# EAGLE board test_board_logic3 (EAGLE 9.3.1)
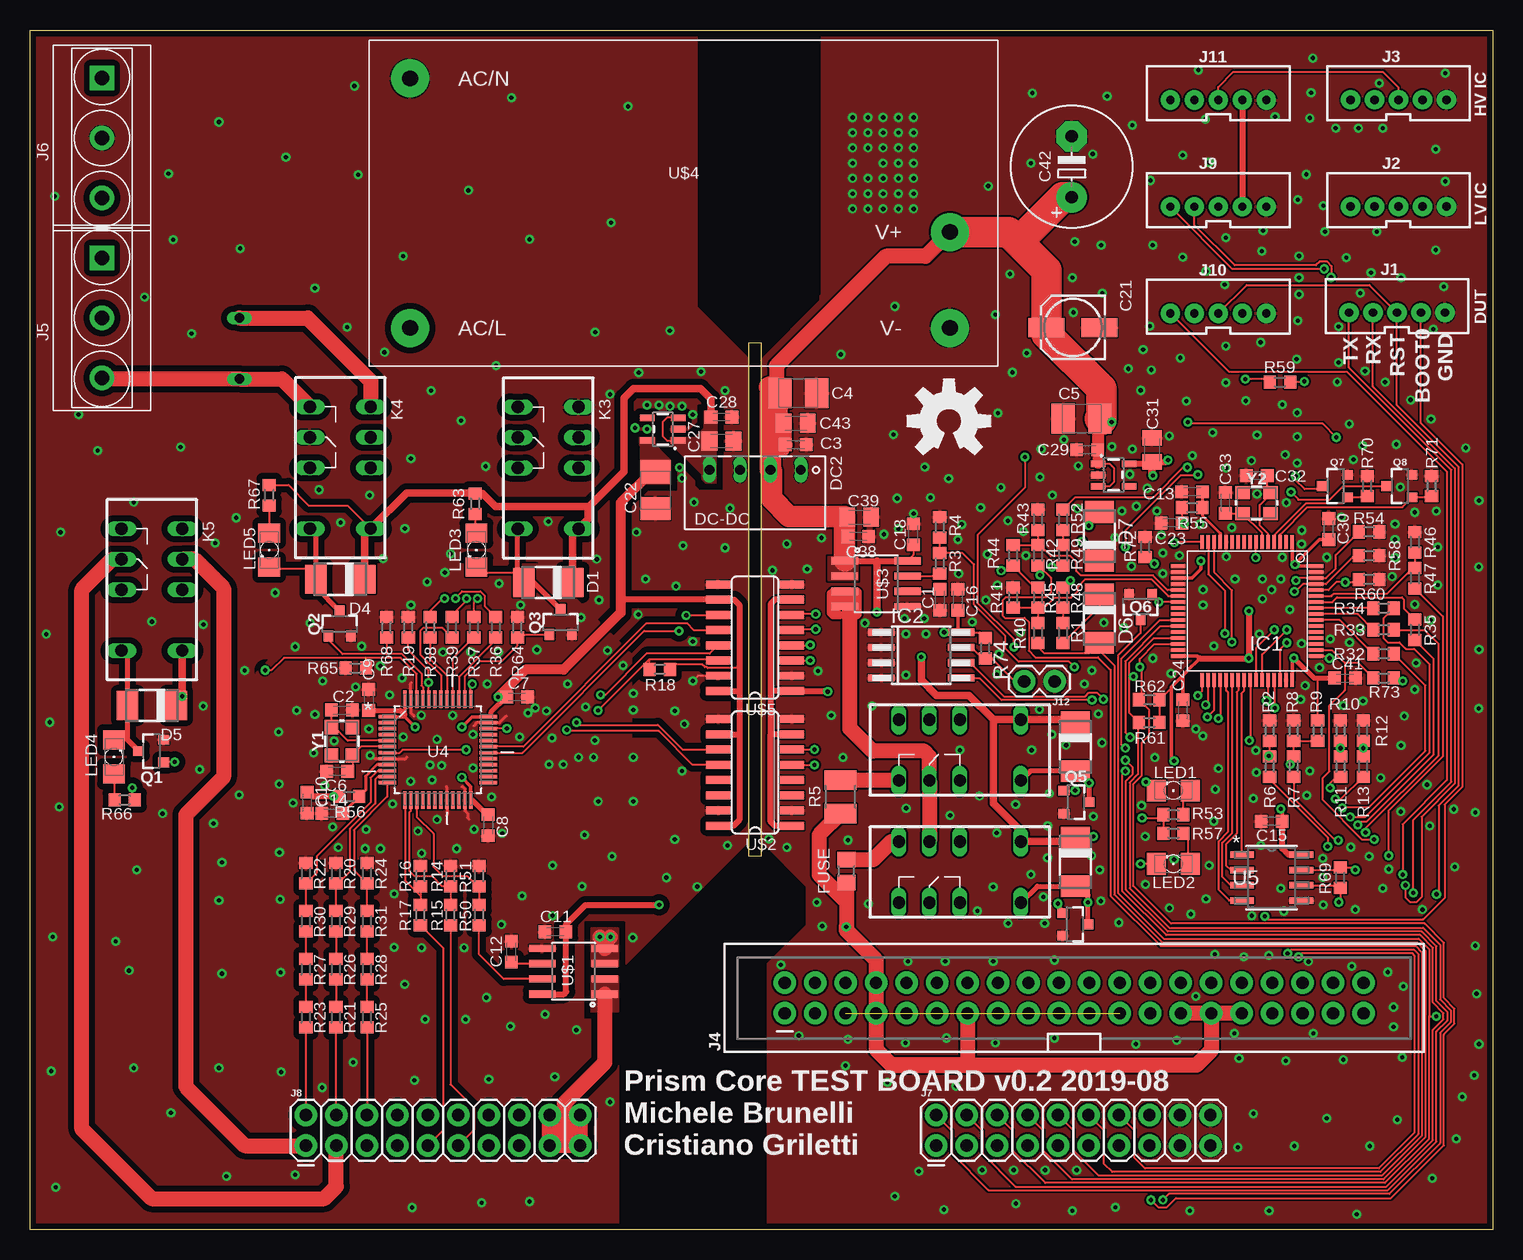
[diagram p5: board, top side]
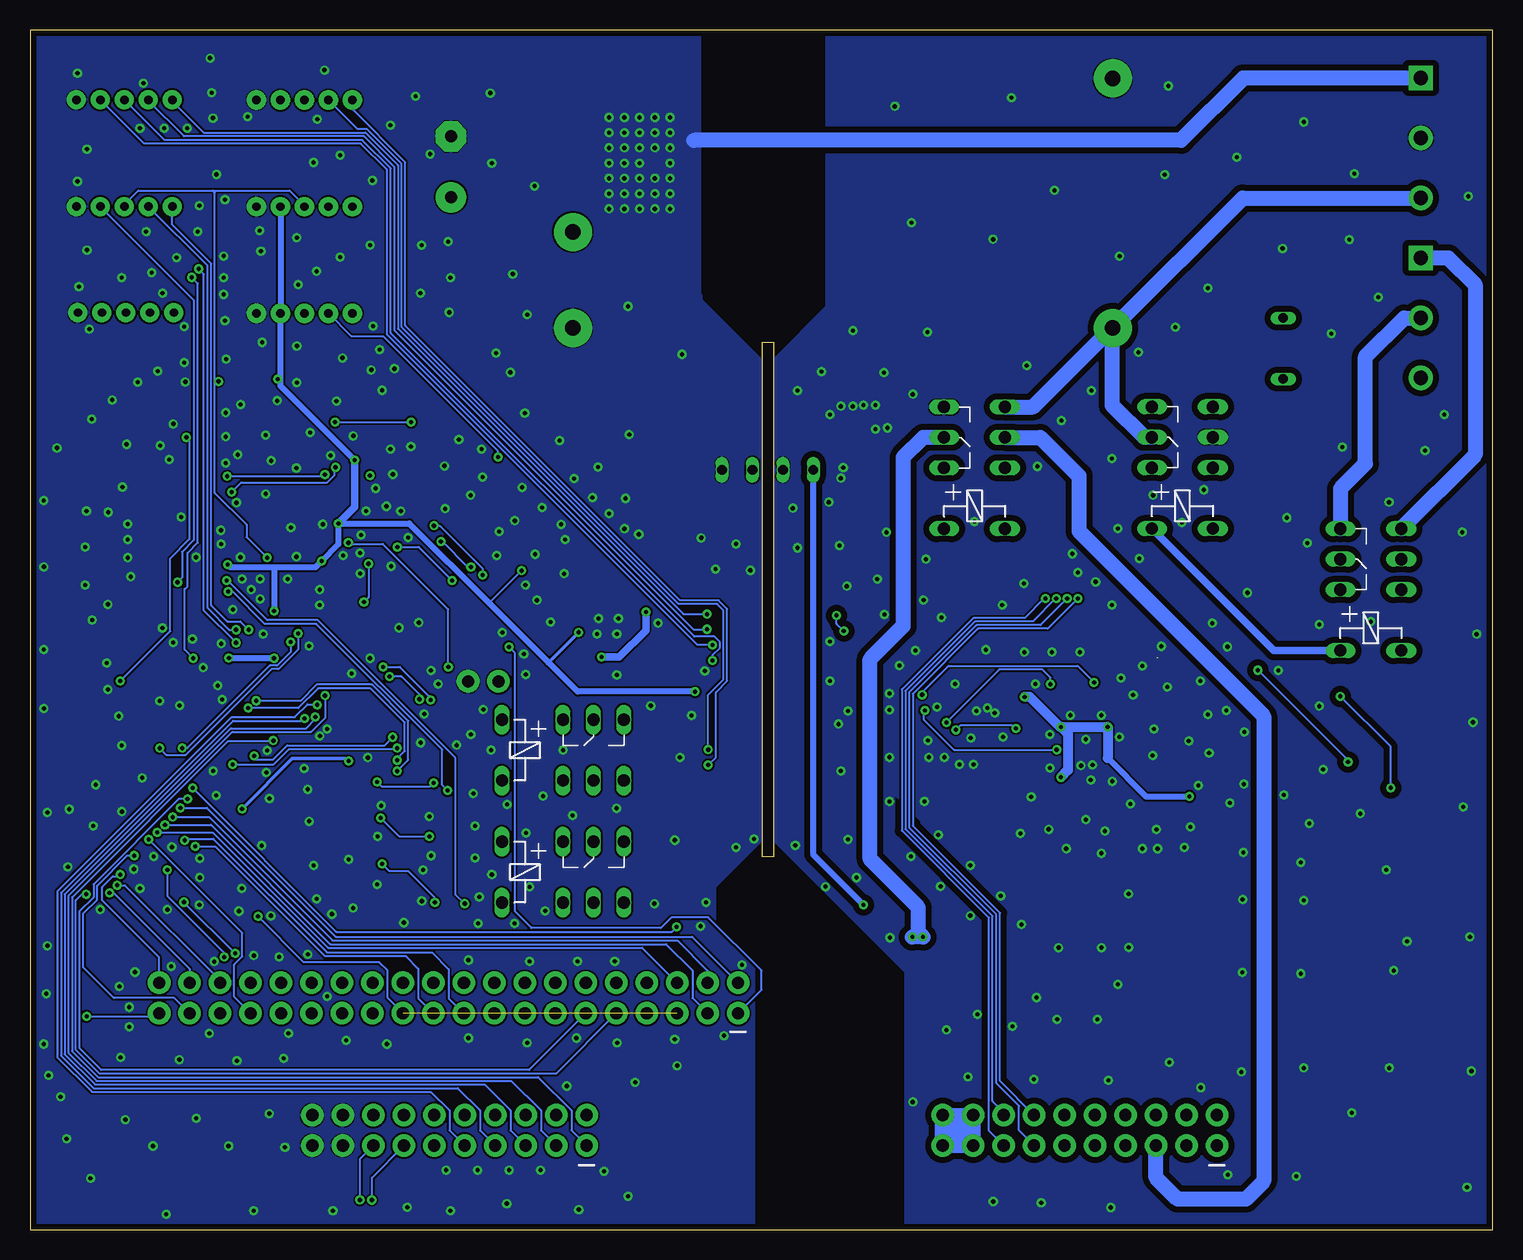
[diagram p6: board, bottom side, seen from below]

Size 121.94 x 100 mm. Coordinates in mm from the lower left corner, seen from the top.
Outline: 0,100 121.94,100 121.94,0 0,0 0,100
Copper layers (1*16): Top 0.035mm / dielectric 1.5mm / Bottom 0.035mm
Design rules "default *": minimum track width 6mil, minimum drill 0.29mm, track to track 6mil, track to pad 6mil, pad to pad 6mil, via to via 6mil, smd to smd 0mil, copper to edge 20mil, drill to drill 6mil, minimum pad ring 5mil, minimum via ring 8mil, stop-mask expansion 4mil, vias tented up to drill 20mil, thermal gap 4mil
Net classes: 1 pwr: width 0.305 mm, drill 0.356 mm, clearance 0.152 mm; 2 analog: width 0.305 mm, drill 0.33 mm, clearance 0.152 mm
Milling: 4 lines

## Footprints (pad centres in the part's own frame; a part is rotated, then mirrored left to right if it is on the bottom)
C0603K = smd 1.05 x 1.08: 1 -0.875,0; 2 0.875,0
C0805K = smd 1.3 x 1.6: 1 -1,0; 2 1,0
B/3528-21R = smd 1.95 x 2.5: + 1.525,0; - -1.525,0
153CLV-0505 = smd 3 x 1.6: + 2.2,0; - -2.2,0
E5-10,5 = drill 1.016 pad 2.54: + -2.54,0 | drill 1.016 pad 2.54 octagon: - 2.54,0
DO-214AC = smd 1.8 x 2.4: A 2.025,0; C -2.025,0
NME = drill 0.813 long: 1 0,3.81; 2 0,1.27; 3 0,-1.27; 4 0,-3.81
R0805 = smd 1.3 x 1.5: 1 -0.95,0; 2 0.95,0
LQFP64 = smd 0.3 x 1.2: 1 -3.75,-5.75; 2 -3.25,-5.75; 3 -2.75,-5.75; 4 -2.25,-5.75; 5 -1.75,-5.75; 6 -1.25,-5.75; 7 -0.75,-5.75; 8 -0.25,-5.75; 9 0.25,-5.75; 10 0.75,-5.75; 11 1.25,-5.75; 12 1.75,-5.75; 13 2.25,-5.75; 14 2.75,-5.75; 15 3.25,-5.75; 16 3.75,-5.75; 33 3.75,5.75; 34 3.25,5.75; 35 2.75,5.75; 36 2.25,5.75; 37 1.75,5.75; 38 1.25,5.75; 39 0.75,5.75; 40 0.25,5.75; 41 -0.25,5.75; 42 -0.75,5.75; 43 -1.25,5.75; 44 -1.75,5.75; 45 -2.25,5.75; 46 -2.75,5.75; 47 -3.25,5.75; 48 -3.75,5.75 | smd 1.2 x 0.3: 17 5.75,-3.75; 18 5.75,-3.25; 19 5.75,-2.75; 20 5.75,-2.25; 21 5.75,-1.75; 22 5.75,-1.25; 23 5.75,-0.75; 24 5.75,-0.25; 25 5.75,0.25; 26 5.75,0.75; 27 5.75,1.25; 28 5.75,1.75; 29 5.75,2.25; 30 5.75,2.75; 31 5.75,3.25; 32 5.75,3.75; 49 -5.75,3.75; 50 -5.75,3.25; 51 -5.75,2.75; 52 -5.75,2.25; 53 -5.75,1.75; 54 -5.75,1.25; 55 -5.75,0.75; 56 -5.75,0.25; 57 -5.75,-0.25; 58 -5.75,-0.75; 59 -5.75,-1.25; 60 -5.75,-1.75; 61 -5.75,-2.25; 62 -5.75,-2.75; 63 -5.75,-3.25; 64 -5.75,-3.75
SO-08M = smd 0.6 x 2.2: 1 -1.905,-3.33; 2 -0.635,-3.33; 3 0.635,-3.33; 4 1.905,-3.33; 5 1.905,3.33; 6 0.635,3.33; 7 -0.635,3.33; 8 -1.905,3.33
JST-5-PTH-VERT = drill 0.7 pad 1.6: 1 -4,0.18; 2 -2,0.18; 3 0,0.18; 4 2,0.18; 5 4,0.18
2X20_SHROUDED = drill 1.016 pad 1.88: 1 -1.27,24.13; 2 1.27,24.13; 3 -1.27,21.59; 4 1.27,21.59; 5 -1.27,19.05; 6 1.27,19.05; 7 -1.27,16.51; 8 1.27,16.51; 9 -1.27,13.97; 10 1.27,13.97; 11 -1.27,11.43; 12 1.27,11.43; 13 -1.27,8.89; 14 1.27,8.89; 15 -1.27,6.35; 16 1.27,6.35; 17 -1.27,3.81; 18 1.27,3.81; 19 -1.27,1.27; 20 1.27,1.27; 21 -1.27,-1.27; 22 1.27,-1.27; 23 -1.27,-3.81; 24 1.27,-3.81; 25 -1.27,-6.35; 26 1.27,-6.35; 27 -1.27,-8.89; 28 1.27,-8.89; 29 -1.27,-11.43; 30 1.27,-11.43; 31 -1.27,-13.97; 32 1.27,-13.97; 33 -1.27,-16.51; 34 1.27,-16.51; 35 -1.27,-19.05; 36 1.27,-19.05; 37 -1.27,-21.59; 38 1.27,-21.59; 39 -1.27,-24.13; 40 1.27,-24.13
H3-5.0-15.5X8.0MM = drill 1.168 pad 2.032 square: 1 0,5 | drill 1.168 pad 2.032: 2 0,0; 3 0,-5
2X10 = drill 1.016 pad 1.88: 1 0,0; 2 0,2.54; 3 2.54,0; 4 2.54,2.54; 5 5.08,0; 6 5.08,2.54; 7 7.62,0; 8 7.62,2.54; 9 10.16,0; 10 10.16,2.54; 11 12.7,0; 12 12.7,2.54; 13 15.24,0; 14 15.24,2.54; 15 17.78,0; 16 17.78,2.54; 17 20.32,0; 18 20.32,2.54; 19 22.86,0; 20 22.86,2.54
1X02 = drill 1.016 pad 1.88: 1 0,0; 2 2.54,0
G6S-2 = drill 1.016 long: 1 -5.08,-2.54; 3 0,-2.54; 4 2.54,-2.54; 5 5.08,-2.54; 8 5.08,2.54; 9 2.54,2.54; 10 0,2.54; 12 -5.08,2.54
1206 = smd 1.6 x 1.803: A -1.422,0; C 1.422,0
SOT23-3 = smd 0.8 x 0.9: 1 -0.95,-1; 2 0.95,-1; 3 0,1.1
R0603 = smd 1 x 1.1: 1 -0.85,0; 2 0.85,0
R1210 = smd 1.6 x 2.7: 1 -1.4,0; 2 1.4,0
SOT23-5 = smd 0.55 x 1.2: 1 -0.95,-1.3; 2 0,-1.3; 3 0.95,-1.3; 4 0.95,1.3; 5 -0.95,1.3
QFP50P900X900X160-48N = smd 1.473 x 0.279: 1 -4.216,2.743; 2 -4.216,2.261; 3 -4.216,1.753; 4 -4.216,1.245; 5 -4.216,0.762; 6 -4.216,0.254; 7 -4.216,-0.254; 8 -4.216,-0.762; 9 -4.216,-1.245; 10 -4.216,-1.753; 11 -4.216,-2.261; 12 -4.216,-2.743; 25 4.216,-2.743; 26 4.216,-2.261; 27 4.216,-1.753; 28 4.216,-1.245; 29 4.216,-0.762; 30 4.216,-0.254; 31 4.216,0.254; 32 4.216,0.762; 33 4.216,1.245; 34 4.216,1.753; 35 4.216,2.261; 36 4.216,2.743 | smd 0.279 x 1.473: 13 -2.743,-4.216; 14 -2.261,-4.216; 15 -1.753,-4.216; 16 -1.245,-4.216; 17 -0.762,-4.216; 18 -0.254,-4.216; 19 0.254,-4.216; 20 0.762,-4.216; 21 1.245,-4.216; 22 1.753,-4.216; 23 2.261,-4.216; 24 2.743,-4.216; 37 2.743,4.216; 38 2.261,4.216; 39 1.753,4.216; 40 1.245,4.216; 41 0.762,4.216; 42 0.254,4.216; 43 -0.254,4.216; 44 -0.762,4.216; 45 -1.245,4.216; 46 -1.753,4.216; 47 -2.261,4.216; 48 -2.743,4.216
21-0041B_8 = smd 1.981 x 0.533: 1 -2.464,1.905; 2 -2.464,0.635; 3 -2.464,-0.635; 4 -2.464,-1.905; 5 2.464,-1.905; 6 2.464,-0.635; 7 2.464,0.635; 8 2.464,1.905
SO08 = smd 0.61 x 2.21: 1 -1.905,-2.616; 2 -0.635,-2.616; 3 0.635,-2.616; 4 1.905,-2.616; 5 1.905,2.616; 6 0.635,2.616; 7 -0.635,2.616; 8 -1.905,2.616
SO16 = smd 0.66 x 2.032: 1 -4.445,-3.073; 2 -3.175,-3.073; 3 -1.905,-3.073; 4 -0.635,-3.073; 5 0.635,-3.073; 6 1.905,-3.073; 7 3.175,-3.073; 8 4.445,-3.073; 9 4.445,3.073; 10 3.175,3.073; 11 1.905,3.073; 12 0.635,3.073; 13 -0.635,3.073; 14 -1.905,3.073; 15 -3.175,3.073; 16 -4.445,3.073
IRM_15/20 = drill 1.3 pad 3.17: AC/L -22.8,-10.4; AC/N -22.8,10.4; V+ 22.2,-2.4; V- 22.2,-10.4
STRIP_NOMIDDLE = drill 0.8 long: P$1 -2.54,0; P$2 2.54,0
CRYSTAL-SMD-3.2X2.5MM = smd 1.2 x 1.1: 1 -1.175,-0.875; 2 1.175,-0.875; 3 1.175,0.875; 4 -1.175,0.875

## Placement (x,y rotation side)
C1  1n  [C0603K]  75.84,52.5 270 top
C2  15p  [C0603K]  26,43.3 0 top
C3  100n  [C0603K]  63.85,65.43 0 top
C4  10u  [C0805K]  63.85,67.22 0 top
C5  22U  [B/3528-21R]  87.66,67.6 0 top
C6  15p  [C0603K]  25.6,38.2 180 top
C7  100n  [C0603K]  40.6,44.4 0 top
C8  100n  [C0603K]  38.2,33.7 270 top
C9  100n  [C0603K]  28.23,44.15 90 top
C10  100n  [C0603K]  23.1,35.6 270 top
C11  100n  [C0603K]  43.81,24.83 0 top
C12  1n  [C0603K]  40.13,23.16 90 top
C13  100n  [C0603K]  96.88,61.5 180 top
C14  100n  [C0603K]  25.2,34.7 180 top
C15  100n  [C0603K]  103.5,34.04 180 top
C16  100n  [C0603K]  77.34,52.5 270 top
C18  100n  [C0603K]  73.64,57.94 270 top
C21  NC  [153CLV-0505]  86.94,75.2 180 top
C22  22U  [B/3528-21R]  52.15,61.63 90 top
C23  100n  [C0603K]  95.18,58.91 180 top
C24  100n  [C0603K]  96.1,43.29 270 top
C27  10u  [C0805K]  57.65,65.73 0 top
C28  100n  [C0603K]  57.65,67.73 0 top
C29  100n  [C0603K]  88.14,65 180 top
C30  100n  [C0603K]  108.26,58.4 90 top
C31  10u  [C0805K]  93.54,65 90 top
C32  15p  [C0603K]  102.27,62.85 180 top
C33  15p  [C0603K]  99.65,60.57 90 top
C38  100n  [C0603K]  69.04,57.78 0 top
C39  10u  [C0805K]  69.14,59.39 0 top
C41  100n  [C0603K]  109.63,45.97 0 top
C42  1000u  [E5-10,5]  86.84,88.6 90 top
C43  22U  [B/3528-21R]  64.05,69.73 180 top
D1  M7  [DO-214AC]  43.2,53.95 180 top
D2  M7  [DO-214AC]  87.14,30.65 270 top
D3  M7  [DO-214AC]  87.14,40.24 270 top
D4  M7  [DO-214AC]  25.87,54.2 180 top
D5  M7  [DO-214AC]  10.16,43.69 180 top
D6  M7  [DO-214AC]  89.15,50.93 270 top
D7  M7  [DO-214AC]  89.15,57.78 90 top
DC2  919-RFM-0505S  [NME]  60.45,63.33 270 top
FUSE  [R0805]  68.06,29.87 90 top
IC1  STM32F103R4T  [LQFP64]  101.47,51.56 180 top
IC2  24AA02SM  [SO-08M]  74.3,47.88 270 top
J1  2001R-5P  [JST-5-PTH-VERT]  113.95,76.25 0 top
J2  2001R-5P  [JST-5-PTH-VERT]  114.08,85.1 0 top
J3  2001R-5P  [JST-5-PTH-VERT]  114.08,94 0 top
J4  CONN_20X2SHROUDED  [2X20_SHROUDED]  87.04,19.3 90 top
J5  GREEN-3P-5.0  [H3-5.0-15.5X8.0MM]  6,76 0 top
J6  GREEN-3P-5.0  [H3-5.0-15.5X8.0MM]  6,91 0 top
J7  [2X10]  75.54,7 0 top
J8  [2X10]  23,7 0 top
J9  2001R-5P  [JST-5-PTH-VERT]  99.06,85.09 0 top
J10  2001R-5P  [JST-5-PTH-VERT]  99.06,76.2 0 top
J11  2001R-5P  [JST-5-PTH-VERT]  99.06,93.98 0 top
J12  [1X02]  85.42,45.69 180 top
K1  G6S-2  [G6S-2]  77.51,39.97 180 top
K2  G6S-2  [G6S-2]  77.51,29.8 180 top
K3  G6S-2  [G6S-2]  43.2,63.5 90 top
K4  G6S-2  [G6S-2]  25.87,63.51 90 top
K5  G6S-2  [G6S-2]  10.16,53.34 90 top
LED1  [1206]  95.31,36.59 180 top
LED2  [1206]  95.31,30.48 180 top
LED3  [1206]  37.21,56.64 270 top
LED4  [1206]  7,39.4 90 top
LED5  [1206]  19.94,56.64 270 top
Q1  BSS138  [SOT23-3]  10.15,39.89 90 top
Q2  BSS138  [SOT23-3]  25.81,50.48 0 top
Q3  BSS138  [SOT23-3]  44.23,50.6 0 top
Q4  BSS138  [SOT23-3]  87.09,25.44 270 top
Q5  BSS138  [SOT23-3]  87.19,35.63 270 top
Q6  BSS138  [SOT23-3]  92.58,51.94 180 top
Q7  BSS138  [SOT23-3]  108.84,61.98 90 top
Q8  BSS138  [SOT23-3]  114.21,61.98 90 top
R1  300  [R0603]  86.11,49.73 270 top
R2  100k  [R0603]  103.34,41.59 270 top
R3  5k  [R0603]  75.84,55.54 90 top
R4  10k  [R0603]  75.84,58.54 90 top
R5  100  [R1210]  67.56,36.06 90 top
R6  300k  [R0603]  103.34,38.59 270 top
R7  300k  [R0603]  105.34,38.59 270 top
R8  100k  [R0603]  105.34,41.59 270 top
R9  40k  [R0603]  107.34,41.59 270 top
R10  100k  [R0603]  109.24,41.59 270 top
R11  300k  [R0603]  109.24,38.59 270 top
R12  100k  [R0603]  111.14,41.59 270 top
R13  300k  [R0603]  111.14,38.59 270 top
R14  100k  [R0603]  35.06,29.47 270 top
R15  300k  [R0603]  35.06,26.22 270 top
R16  100k  [R0603]  32.55,29.47 270 top
R17  300k  [R0603]  32.55,26.22 270 top
R18  10k  [R0603]  52.5,46.7 0 top
R19  10k  [R0603]  31.54,50.2 270 top
R20  3k  [R0603]  25.5,29.7 270 top
R21  300k  [R0603]  25.5,17.7 270 top
R22  3k  [R0603]  23,29.7 270 top
R23  300k  [R0603]  23,17.7 270 top
R24  10k  [R0603]  28.1,29.7 270 top
R25  453k  [R0603]  28.1,17.7 270 top
R26  300k  [R0603]  25.5,21.7 270 top
R27  300k  [R0603]  23,21.7 270 top
R28  453k  [R0603]  28.1,21.7 270 top
R29  300k  [R0603]  25.5,25.7 270 top
R30  300k  [R0603]  23,25.7 270 top
R31  453k  [R0603]  28.1,25.7 270 top
R32  1k  [R0603]  112.84,48 0 top
R33  1k  [R0603]  112.84,50 0 top
R34  1k  [R0603]  112.84,51.8 0 top
R35  1k  [R0603]  115.44,50 270 top
R36  1k  [R0603]  38.82,50.2 90 top
R37  1k  [R0603]  37,50.2 90 top
R38  1k  [R0603]  33.36,50.2 90 top
R39  1k  [R0603]  35.18,50.2 90 top
R40  300k  [R0603]  84.03,49.73 270 top
R41  100k  [R0603]  81.95,52.69 270 top
R42  300k  [R0603]  84.03,56.2 270 top
R43  100k  [R0603]  84.03,59.17 270 top
R44  82k  [R0603]  81.95,56.2 90 top
R45  82k  [R0603]  84.03,52.69 270 top
R46  100k  [R0603]  115.44,57.3 270 top
R47  300k  [R0603]  115.44,54.3 270 top
R48  1k  [R0603]  86.11,52.69 270 top
R49  300  [R0603]  86.11,56.2 270 top
R50  5k  [R0603]  37.44,26.22 90 top
R51  10k  [R0603]  37.44,29.47 90 top
R52  1k  [R0603]  86.11,59.17 270 top
R53  1k  [R0603]  95.31,34.58 0 top
R54  10k  [R0603]  111.62,58.17 180 top
R55  0  [R0603]  96.88,60.18 0 top
R56  0  [R0603]  26.6,36.1 0 top
R57  1k  [R0603]  95.31,33.02 0 top
R58  10k  [R0603]  111.62,56.18 0 top
R59  10k  [R0603]  104.2,70.64 180 top
R60  10k  [R0603]  111.62,54.2 180 top
R61  4.7k  [R0603]  93.31,42.27 0 top
R62  4.7k  [R0603]  93.31,44.16 0 top
R63  1k  [R0603]  37.11,60.51 270 top
R64  10k  [R0603]  40.64,50.2 270 top
R65  10k  [R0603]  27.15,46.81 0 top
R66  1k  [R0603]  7.89,35.81 180 top
R67  1k  [R0603]  19.94,61.21 270 top
R68  10k  [R0603]  29.72,50.2 270 top
R69  120  [R0603]  109.22,29.34 90 top
R70  10k  [R0603]  111.47,61.98 270 top
R71  10k  [R0603]  116.84,61.98 270 top
R72  10k  [R0603]  92.96,56.9 90 top
R73  10k  [R0603]  112.84,45.97 0 top
R74  10k  [R0603]  79.64,48.46 270 top
U1  AP2112K-3.3TRG1  [SOT23-5]  52.75,66.73 90 top
U3  AP2112K-3.3TRG1  [SOT23-5]  90.34,62.9 270 top
U4  STM32F103CBT6  [QFP50P900X900X160-48N]  34,40 0 top
U5  MAX3485AEASA+  [21-0041B_8]  103.5,29.34 0 top
U$1  ACS712  [SO08]  45.31,21.53 90 top
U$2  SI8441IS1  [SO16]  60.45,38.1 90 top
U$3  ACS712  [SO08]  70.54,53.84 270 top
U$4  NC  [IRM_15/20]  54.49,85.56 0 top
U$5  SI8441IS1  [SO16]  60.44,49.34 90 top
U$6  2 PIN STRIP F  [STRIP_NOMIDDLE]  17.46,73.45 270 top
U$7  OSHW-LOGOL  [OSHW-LOGO-L]  76.6,67.4 0 top
Y1  8MHz  [CRYSTAL-SMD-3.2X2.5MM]  26,40.7 90 top
Y2  8MHz  [CRYSTAL-SMD-3.2X2.5MM]  102.25,60.57 0 top

## Tracks (layer width: path | path; a pad name or v marks a point on that pad's centre or on a via)
1_AC
  Top 1.27: J8.3 25.54,3.58 24.53,2.57 10.13,2.57 4.32,8.38 4.32,53.34 6.86,55.88 K5.9
1_AC1
  Top 0.152: R26.2 R21.1
1_AC2
  Top 0.152: R29.2 R26.1
1_AC_EXT
  Bottom 1.27: J5.1 3.7,81 1.47,78.77 1.47,64.57 K5.8
1_AC_SENSE_HV
  Top 0.152: J8.4 25.5,9.58 R21.2
2_AC
  Top 1.27: J8.1 17.89,7 12.98,11.91 12.98,34.57 16.13,37.72 16.13,53.47 13.72,55.88 K5.4
2_AC1
  Top 0.152: R23.1 R27.2
2_AC2
  Top 0.152: R27.1 R30.2
2_AC_EXT
  Bottom 1.27: J5.2 7.4,76 10.62,72.78 10.62,63.84 12.7,61.76 K5.5
2_AC_SENSE_HV
  Top 0.152: J8.2 R23.2
3.3V_HV_SENSE
  Top 0.152: R16.2 32.55,27.81 | 32.55,27.81 R17.1 | U4.13 31.26,29.1 32.55,27.81
3.3V_LV_SENSE  (via drill 0.35)
  Top 0.152: R12.2 v111.14,40.13 R13.1 | IC1.15 98.22,54.65 99.6,53.27 v99.6,49.7
  Bottom 0.152: v111.14,40.13 110.53,39.52 108.99,39.52 101.8,46.71 101.22,46.71 99.6,48.34 v99.6,49.7
3.3V_TEST  (via drill 0.35)
  Top 0.152: v108.81,35.88 109.28,35.88 R13.2
  Bottom 0.152: J4.11 80.33,13.3 116.01,13.3 117.83,15.13 117.83,26.52 116.65,27.7 116.65,28.79 109.55,35.88 v108.81,35.88
5V_CURR_MEAS_RELAY  (via drill 0.35)
  Top 0.152: Q4.1 86.09,26.68 85.7,27.07 v85.7,27.17 | R54.2 108.84,56.23 108.84,55.12 108.03,54.31 IC1.62 105.75,54.31 v105.54,54.1
  Bottom 0.152: v85.7,27.17 86.49,27.96 86.49,39.34 97.94,50.8 102.16,50.8 105.46,54.1 v105.54,54.1
5V_HV_SENSE
  Top 0.152: R15.1 R14.2 34.37,28.62 33.53,29.47 32.03,29.47 31.61,29.88 31.61,34.77 31.74,34.9 U4.14
5V_LV_SENSE  (via drill 0.35)
  Top 0.152: R10.2 v109.24,40.13 R11.1 | v100.2,48.98 100.21,53.29 98.72,54.77 IC1.14
  Bottom 0.152: v109.24,40.13 108.83,40.13 101.95,47.02 101.35,47.02 100.2,48.16 v100.2,48.98
5V_TEST
  Top 0.152: R15.2 35.06,12.09 37,10.14 37,8.3 J8.11
5V_TEST_RELAY  (via drill 0.35)
  Top 0.152: v87.12,36.59 87.11,36.58 Q5.1 | R58.1 110.65,56.05 110.27,56.05 108.03,53.81 IC1.61 106.11,53.81 105.49,53.19 v105.41,53.19
  Bottom 0.152: v87.12,36.59 87.58,37.05 87.58,40.01 98.07,50.49 102.36,50.49 105.06,53.19 v105.41,53.19
220_RELAY
  Top 0.152: U4.38 36.26,46.13 37.54,47.41 39.37,47.41 40.64,48.68 R64.2 40.89,49.6 Q3.1
220_RELAY_1  (via drill 0.35)  (1 unrouted)
  Top 0.152: U4.46 32.25,46.32 30.9,47.67 28,47.67 R65.2 | v19.59,46.63 20.13,46.63 21.17,47.67 27.94,47.67 | v12.06,38.99 11.2,38.99 Q1.1
  Bottom 0.152: v19.59,46.63 12.06,39.1 v12.06,38.99
485_DE
  Top 0.152: U5.3 100.1,28.7 99.39,29.41 99.39,32.24 100.22,33.07 IC1.38
485_DI
  Top 0.152: U5.4 99.97,27.43 99.08,28.32 99.08,32.36 99.85,33.13 99.85,44.8 99.72,44.92 IC1.37
485_RE
  Top 0.152: IC1.39 100.72,44.92 100.6,44.8 100.6,33.01 99.69,32.11 99.69,30.37 100.1,29.97 U5.2
485_RO
  Top 0.152: U5.1 100.97,31.31 100.97,44.67 101.22,44.92 IC1.40
+3V3  (via drill 0.35)
  Top 0.152: v80.96,54.92 81.46,54.92 81.89,55.35 R44.1 83.77,53.54 R45.1 | R61.2 94.18,42.29 94.18,44.14 R62.2 95.13,45.14 95.13,45.22 | C23.1 96.03,58.94 96.03,59.88 R55.1 | R9.1 107.34,45.95 107.31,45.97 | IC2.8 79.17,49.78 R74.1 | R59.2 103.1,70.89 v101.3,70.89
  Top 0.305: C30.1 107.5,57.52 105.46,55.48 v105.46,55.45 | IC1.1 105.22,55.68 v105.46,55.45 | v105.46,55.45 105.59,55.31 IC1.64 | IC1.48 105.22,47.51 v105.36,47.65 | IC1.32 97.32,47.81 97.51,47.62 96.39,46.51 96.39,46.48 96.1,46.19 | 96.1,46.19 96.1,44.39 | IC1.19 96.86,54.31 97.62,55.07 v97.62,55.73 | C15.1 104.38,34.94 v104.27,35.05 | v95.38,39.05 95.13,39.3 95.13,45.22 96.1,46.19 | v76.2,49.78 IC2.8 77.34,50.07 C16.2
  Top 0.406: 93.54,63.85 C31.1 | 96.1,44.39 C24.1 | v105.36,47.65 107.04,45.97 107.31,45.97 C41.1
  Top 0.508: U3.5 93.54,63.85 | U$5.7 62.12,52.52 61.74,52.14 61.74,44.9 | v66.5,44.84 66.45,44.9 U$5.1 61.74,44.9 | C31.1 94.73,64 v94.87,64.14 | J11.4 J9.4 | U$2.7 61.74,41.27 | 61.74,44.9 61.74,41.27 | U$2.1 62.1,33.66 61.74,34.02 61.74,41.27 | v101.6,51.56 v101.6,47.62 97.51,47.62 | U5.8 104.9,31.24 104.38,31.76 C15.1
  Top 0.61: v96.24,58.87 96.2,58.9 C23.1 | C31.1 93.54,62.92 v93.6,62.87
  Bottom 0.152: v80.96,54.92 83.66,52.21 | v97.62,55.73 97.64,55.73 | v101.3,70.89 v101.29,70.9 101.06,70.9
  Bottom 0.305: v104.27,35.05 100.07,39.25 95.58,39.25 v95.38,39.05 | v76.2,49.78 78.72,47.27
  Bottom 0.508: v66.5,44.84 76.29,44.84 78.72,47.27 83.66,52.21 90.31,58.87 v96.24,58.87 96.24,57.13 97.64,55.73 98.15,55.22 101.6,55.22 | v94.87,64.14 101.06,70.33 101.06,70.9 J10.4 J9.4 | v105.46,55.45 105.23,55.22 101.6,55.22 | v101.6,47.62 105.34,47.62 v105.36,47.65 | 101.6,55.22 v101.6,51.56
  Bottom 0.61: v96.24,58.87 94.87,60.23 v94.87,64.14
+5V  (via drill 0.35)
  Top 0.152: U1.3 53.1,67.68 52.75,67.33 52.75,66.13 53.1,65.78 U1.1 | D5.C 12.19,43.94 v12.7,44.45 | R63.1 37.11,61.4 | R67.1 21.55,62.06 23.28,60.33 26.5,60.33 K4.1 | R66.1 8.47,36.09 8.47,36.79 v8.51,36.83 | 46.5,60.2 46.5,60.23 46.54,60.26
  Top 0.508: U$1.8 44.5,19.62 44.71,19.83 44.71,24.8 C11.2 44.68,25.43 46.3,27.05 v52.45,27.05
  Top 0.61: C28.1 56.77,69.23 55.9,70.1 50.3,70.1 49.5,69.3 49.5,63.2 46.5,60.2 | 37.11,61.4 31.38,61.4 K4.1 27.89,57.91 D4.C | R63.1 37.71,61.36 38.81,60.26 46.54,60.26 46.54,59.22 K3.1 45.23,57.91 D1.C | K5.1 v12.7,44.45
  Bottom 0.152: v8.51,36.83 8.51,40.26 v12.7,44.45
  Bottom 0.508: DC2.4 56.64,31.24 v52.45,27.05
  Bottom 0.61: K4.1 18.24,48.26 K5.1
  pour Top (no thermals): 57.15,65.03 57.15,62.23 56.35,62.23 56.05,62.53 56.05,62.93 53.45,65.53 53.45,66.03 55.45,66.03 56.25,66.83 56.25,68.23 57.25,68.23 57.25,65.03
+12V  (via drill 0.35)
  Top 0.152: R6.2 103.34,37.52 108.17,32.68 v108.17,31.94
  Bottom 0.152: v108.17,31.94 106.5,31.94 97.36,22.8 90.64,22.8 89.58,21.73 89.58,19.29 88.32,18.03 J4.21
+12V_SENSE  (via drill 0.35)
  Top 0.152: R6.1 103.34,39.48 | 103.34,39.48 R2.2 | v91.71,41.04 91.3,41.44 91.3,47.37 94.24,50.31 IC1.27 | v103.26,39.48 103.34,39.48
  Bottom 0.152: v91.71,41.04 92.38,40.37 100.48,40.37 101.67,39.18 103.26,39.18 v103.26,39.48
-12V  (via drill 0.35)
  Top 0.152: R7.2 105.34,35.95 108.83,32.45 v109.06,32.45
  Bottom 0.152: v109.06,32.45 108.93,32.58 106.66,32.58 97.18,23.1 88.44,23.1 87.04,21.7 87.04,19.29 85.78,18.03 J4.19
-12V_SENSE  (via drill 0.35)
  Top 0.152: R9.2 R8.2 R7.1 105.05,39.16 v105.05,38.78 | v91.33,40.13 91.27,40.13 91,40.41 91,47.62 94.19,50.81 IC1.26
  Bottom 0.152: v105.05,38.78 101.61,38.78 100.33,40.06 91.4,40.06 v91.33,40.13
_AUX2  (via drill 0.35)
  Top 0.152: J7.4 79.38,8.24 79.38,6.35 82.15,3.58 113.07,3.58 116.94,7.45 116.94,16.64 117.83,17.53 117.83,18.03 116.94,18.92 116.94,23.48 115.88,24.54 94.71,24.54 91.06,28.19 91.06,37.95 v91.33,38.21 | v103.08,44.08 103.22,44.23 IC1.44
  Bottom 0.152: v91.33,38.21 91.33,38.24 90.4,39.16 90.4,42.4 93.42,45.42 98.06,45.42 99.4,44.08 v103.08,44.08
_AUX3  (via drill 0.35)
  Top 0.152: J7.2 76.83,8.24 76.83,6.35 79.91,3.27 113.2,3.27 117.25,7.32 117.25,16.51 118.13,17.4 118.13,18.16 117.25,19.05 117.25,23.61 116.01,24.85 94.84,24.85 91.37,28.32 91.37,37.4 91.93,37.96 91.93,38.52 v91.33,39.12 | v103.76,43.48 103.76,45.78 IC1.45
  Bottom 0.152: v91.33,39.12 91.33,39.26 90.71,39.88 90.71,42.27 93.55,45.11 97.93,45.11 99.57,43.48 v103.76,43.48
AC_1_SENSE
  Top 0.152: R29.1 R20.2 25.7,28.85 26.7,29.84 26.7,33.43 28.78,35.52 28.78,37.54 28.98,37.74 U4.11
AC_2_SENSE
  Top 0.152: R30.1 R22.2 23.9,29.75 23.9,31.1 28.38,35.58 28.38,37.65 28.98,38.25 U4.10
AUX1  (via drill 0.35)
  Top 0.152: v97.35,44.51 97.72,44.88 IC1.33
  Bottom 0.152: J7.3 79.35,8.27 79.35,9.92 81.82,12.39 116.39,12.39 118.74,14.75 118.74,27.82 105.08,41.48 98.5,41.48 97.35,42.63 v97.35,44.51
AUX4  (via drill 0.35)
  Top 0.152: IC1.41 101.72,40.83 v101.65,40.76
  Bottom 0.152: J7.1 76.81,8.27 76.81,9.92 79.58,12.7 116.26,12.7 118.44,14.87 118.44,27.69 105.42,40.72 101.69,40.72 v101.65,40.76
CD_HV  (via drill 0.35)
  Top 0.152: v36.39,52.6 36.39,52.44 35.18,51.23 R39.2
  Bottom 0.152: J8.16 40.78,9.78 41.7,10.7 41.7,26.13 48.96,33.39 48.96,44.9 43.17,50.7 38.35,50.7 36.44,52.6 v36.39,52.6
CS_LV  (via drill 0.35)
  Top 0.152: R35.2 116.97,47.62 116.97,39.56 111.4,33.99 110.94,33.99 v110.69,33.74
  Bottom 0.152: J4.3 66.72,19.3 66.72,21.6 68.91,23.79 96.9,23.79 106.85,33.74 v110.69,33.74
CURR_MEAS  (via drill 0.35)
  Top 0.152: R4.1 R3.2 77.75,56.39 78.69,55.45 78.69,52.11 81.31,49.49 81.31,48.42 82.4,47.34 86.62,47.34 v87.07,46.89 | IC1.16 95.45,57.31 v95.4,57.25
  Bottom 0.152: v87.07,46.89 87.07,51.69 92.53,57.15 95.3,57.15 v95.4,57.25
EV_CHARGING
  Top 0.152: IC1.3 104.22,57.96 106.49,60.23 114.41,60.23 Q8.1 116.74,61.03 R71.2
EV_CHARGING_1
  Top 0.152: IC1.4 103.72,57.89 106.36,60.53 109.47,60.53 109.84,60.9 Q7.1 111.37,61.03 R70.2
GND  (via drill 0.35)
  Top 0.152: U$5.15 55.68,46.16 v55.25,45.73
  Top 0.254: 31.8,45.6 31.74,45.54 U4.47 31.74,43.06 32,42.8 | 28.7,39.3 28.76,39.24 U4.8 31.29,39.24 31.43,39.37 | 34.7,36.9 34.76,36.84 U4.20 34.76,34.56 34.7,34.5 | 36,36.9 36.1,36.9 36.26,36.74 U4.23 36.26,34.9 36.47,34.69 36.47,34.33 36.6,34.2 | 37,42 37.26,42.26 U4.35 39.16,42.26 39.7,42.8
  other vias: 25.7,31.85 28.03,33.35 39.3,25.42 30.36,27.98 27.94,31.75 29.21,31.75 39.37,33.02 43.28,38.77 44.45,38.77 45.72,39.37 46.99,39.37 24.38,45.72 23.75,42.93 20.76,37.13 20.79,31.43 29.21,46.99 31.75,52.07 44.82,45.47 42.12,43.47 41.52,43.07 40.82,41.07 34.32,38.67 33.92,40.87 31.12,41.07 35.22,42.87 36.92,41.27 31.72,37.37 30.22,35.47 37.02,33.37 17.89,46.62 22.11,48.59 42.25,48.33 45.95,51.03 53.75,43.23 54.55,42.13 54.35,38.23 53.85,53.63 47.45,52.47 39.09,53.85 54.45,57.03 57.95,56.83 58.35,60.13 55.35,60.63 50.55,58.13 54.35,62.63 57.95,69.93 55.25,67.93 54.35,68.63 53.35,68.63 52.45,68.73 51.45,68.73 50.45,66.83 51.45,66.73 54.15,63.53 48.35,69.63 50.75,71.43 55.95,71.53 43.2,59.03 34.58,54.77 35.95,67.43 33.45,69.93 38.85,72.03 29.55,73.13 26.45,75.23 31.25,58.43 35.05,56.33 33.11,54 29.45,55.93 17.18,59.33 24.09,61.67 15.45,57.23 14.45,50.43 14.45,43.63 14.14,38.35 15.29,33.85 30.35,23.53 20.85,27.53 20.88,21.43 32.95,17.53 38.05,19.33 40.05,16.93 38.25,12.53 42.95,17.93 45.55,16.63 43.75,12.73 48.35,10.63 50.25,24.33 53.05,29.33 53.75,32.53 58.15,32.03 46.03,28.59 2.45,35.23 1.35,49.63 2.55,58.13 8.65,60.63 5.65,64.93 12.55,65.23 4.05,67.93 9.55,77.73 11.95,82.53 2.05,86.13 11.55,88.03 15.75,92.33 27.05,95.33 36.55,86.63 27.35,87.93 48.45,83.93 49.85,93.63 32.05,12.43 24.35,11.83 26.95,13.93 20.95,13.13 11.75,9.73 7.15,24.03 2.15,3.53 31.85,1.83 37.65,2.23 41.65,2.33 31.01,45.99 29.98,44.57 27.14,45.23 27.64,48.63 33.36,38.73 20.72,41.47 25.22,33.57 22.22,43.27 21.92,35.57 33.92,34.17 33.52,37.47 43.52,40.97 46.32,43.57 47.09,40.77 32.34,33.21 32.64,31.37 41.02,27.81 43.56,30.35 46.23,32.89 48.51,31.11 43.56,26.16 50.29,35.69 47.37,35.69 50.29,39.37 50.29,43.31 50.29,44.69 35.56,31.75 36.2,23.5 32.64,23.5 36.32,17.53 31.24,20.45 15.75,13.46 16,21.34 15.75,27.43 16,30.61 8.89,29.97 8.26,21.59 8.64,13.46 1.78,13.21 1.91,24.38 1.65,42.29 10.16,50.67 28.32,61.21 31.75,64.26 37.97,63.63 31.11,81.15 23.75,78.49 17.53,81.79 21.34,89.41 13.46,74.68 40.13,94.36 41.66,82.55 47.12,74.8 51.31,54.23 50.7,51.28 22.1,4.57 16.38,4.45 53.34,74.93 47.24,55.88 40.89,52.07 38.48,36.07 55.63,28.57 20.45,53.09 23.37,50.55 25.91,58.93 17.43,36.23 11.05,34.67 34.42,48.13 48.13,48.26 39.05,48.13 36.75,48.13 43.05,43.23 55.25,49.03 49.45,47.03 36.92,38.47 38.12,45.47 32.62,42.87 28.35,39.53 28.25,41.73 25.35,40.73 24.55,37.03 23.65,39.73
  pour Top (isolate 0.5, rank 2): 55.57,104 55.57,76.94 59.85,72.66 59.85,32.31 49,21.46 49,-2 -2,-2 -2,104
  pour Bottom (isolate 0.5, rank 2): 55.57,104 55.57,76.94 59.85,72.66 59.85,32.31 49,21.46 49,-2 -2,-2 -2,104
  pour Top (isolate 0.152): 18.9,46.43 27.97,55.5 42.6,55.5 50.1,48 50.1,36.5 44.5,30.9 22.9,30.9 18.9,34.9
  pour Bottom (isolate 0.152): 20.5,42.13 33.87,55.5 42,55.5 50.1,47.4 50.1,36.5 44.5,30.9 22.9,30.9 20.5,33.3
GNDIO  (via drill 0.35)
  Bottom 1.27: J6.1 20.8,96 26,90.8 66.6,90.8
  other vias: 68.58,91.44 69.85,91.44 71.12,91.44 72.39,91.44 73.66,91.44 73.66,90.17 72.39,90.17 71.12,90.17 69.85,90.17 68.58,90.17 68.58,88.9 71.12,88.9 72.39,88.9 73.66,88.9 73.66,87.63 72.39,87.63 71.12,87.63 69.85,87.63 68.58,87.63 68.58,86.36 69.85,86.36 71.12,86.36 72.39,86.36 73.66,86.36 68.58,92.71 69.85,92.71 71.12,92.71 72.39,92.71 73.66,92.71 68.58,85.09 69.85,85.09 71.12,85.09 72.39,85.09 73.66,85.09 72.39,58.42 73.66,59.69 76.58,62.61 77.42,54.67 77.67,58.79 83.5,39.97 85.19,41.26 77.51,39.97 80.93,61.87 84.29,65.06 93.49,71.66 86.19,65.86 87.39,63.66 91.69,62.96 91.89,65.06 90.19,65.26 94.99,66.16 109.99,67.16 111.09,65.36 108.99,70.66 109.09,72.26 105.59,72.56 104.39,68.76 113.89,65.46 116.79,67.56 119.69,65.16 115.09,69.16 112.96,70.64 111.29,71.56 116.99,75.06 109.09,75.26 105.69,75.76 120.79,60.76 120.79,48.36 120.49,34.76 114.29,40.36 112.59,37.66 113.19,21.46 114.49,20.26 114.39,14.36 104.69,14.06 100.79,14.26 100.39,16.36 106.99,16.36 109.49,14.16 120.49,23.66 120.59,19.66 120.79,15.46 120.39,12.86 119.39,11.06 118.89,7.56 116.89,4.26 110.59,1.26 111.69,6.96 113.99,9.16 108.09,9.26 101.99,9.66 100.69,6.86 105.39,6.96 103.29,1.56 96.69,1.56 86.89,1.56 90.49,1.86 82.19,2.16 72.09,2.76 74.09,4.86 76.19,1.66 77.19,11.96 80.49,15.56 85.39,15.96 92.19,15.46 95.59,15.76 85.39,22.46 76.29,22.36 80.29,22.36 73.19,22.36 78.99,26.56 79.16,36.13 73.04,35.12 66.04,25.29 68.19,32.46 62.59,22.06 64.09,16.16 68.19,15.86 72.99,15.56 76.39,15.96 71.49,12.26 67.99,13.66 66.79,42.86 70.19,43.66 65.69,46.56 64.79,55.06 63.09,57.16 61.89,54.96 72.29,60.96 74.59,63.56 77.79,65.76 80.69,68.06 71.99,66.26 75.06,61.02 71.19,57.96 67.59,72.96 72.09,76.96 81.69,79.66 80.49,76.26 81.89,71.46 83.09,73.06 86.89,79.36 89.39,78.06 89.29,82.06 87.09,82.36 88.59,89.66 93.59,82.06 96.09,81.06 95.89,72.66 92.59,69.96 96.39,69.06 99.69,73.66 102.59,73.96 99.59,78.76 102.69,81.56 102.79,83.26 106.39,87.96 98.29,88.96 93.39,87.46 114.29,79.36 117.19,81.66 117.19,90.06 106.79,94.76 103.79,92.76 97.99,92.56 97.39,96.66 91.89,92.06 96.09,89.56 92.99,28.78 100.19,58.53 88.65,34.44 84.99,36.36 80.59,33.06 80.29,28.56 84.2,62.74 84.58,25.53 81.53,25.53 84.48,27.74 83.44,29.59 84.84,30.99 84.84,33.66 67.77,39.34 82.17,35.43 76.7,34.52 88.49,31.17 95,26.8 92.96,32.77 92.66,35.34 117.35,53.72 117.35,56.9 120.78,55.24 99.69,70.61 101.35,69.09 93.34,75.31 91.57,71.75 99.69,82.68 98.04,79.88 107.82,85.34 107.95,83.19 112.78,91.82 110.74,91.82 108.84,91.82 109.73,81.03 112.27,83.19 77.34,57.53 79.25,60.2 79.88,87 83.57,94.74 89.79,94.49 83.44,88.9 106.93,97.66 117.98,96.39 117.98,87.38 117.86,78.61 116.46,37.08 114.55,42.8 120.78,43.43 85.22,61.21 91.19,50.16 113.79,58.8 113.79,56.01 113.79,57.53 95.38,30.86 80.64,53.72 79.68,52.46 97.79,53.34 97.79,52.07 100.46,54.23 102.74,54.23 104.27,54.23 102.74,52.58 103.5,53.34 105.03,51.69 102.49,49.66 98.68,48.64 105.92,44.2 109.47,43.69 111.12,44.07 106.3,45.34 106.68,38.23 106.43,36.2 101.98,35.94 102.23,38.1 102.62,32 98.04,27.56 96.77,26.29 101.85,26.16 104.52,26.54 111.63,31.11 110.11,31.88 110.49,26.67 107.82,27.05 112.78,28.45 116.08,26.67 113.67,18.54 113.67,16.89 79.38,4.95 82,4.95 84.62,4.95 87.25,4.95 84.16,43.35 80.61,46.26 78.55,50.65 73.03,49.66 73.03,46.23 72.9,50.93 74.55,50.93 74.68,49.66 69.6,50.55 87.9,45.48 80.77,47.98 88.52,46.61 93.6,47.62 95.12,46.35 98.81,36.7 98.68,34.04 98.3,30.35 82.57,49.78 89.07,42.98 89.37,40.58 86.37,40.38 90.77,25.58 89.27,27.38 89.17,29.98 105.79,77.96 110.89,78.06 111.79,79.76 105.79,79.36 105.79,81.16 105.69,85.86 112.49,95.56 106.69,92.66 92.79,73.36 86.99,76.46 65.99,57.66 61.59,32.56 63.09,31.86 65.59,27.26 69.89,27.16 107.5,46.84 106,48.84 108.4,49.24 110,48.94 110.9,50.14 108.1,56.04 104.4,56.04 106,57.14 106.03,58.29 109.33,59.39 115.43,59.79 117.23,59.89 114.23,61.89 104.63,64.59 101.83,64.09 99.73,56.09 97.53,58.79 95.83,56.19 94.33,57.89 93.93,59.89 94.43,56.39 94.43,54.69 91.83,55.29 90.43,57.69 92.23,60.29 87.33,60.09 93.13,61.79 91.03,59.89 83.03,56.19 82.83,58.19 79.83,56.29 81.53,59.09 89.53,50.59 102.29,66.23 99.73,63.49 105.63,66.09 105.63,68.09 110.33,64.19 98.59,66.43 96.89,64.53 97.18,41.74 99.08,38.44 93.78,39.34 97.78,41.14 102.18,39.94 107.78,30.94 104.28,28.44 107.78,29.34 114.28,34.84 116.68,33.64 118.68,35.04 118.78,30.24 113.28,30.04 110.18,21.94 106.58,22.34 103.28,22.84 101.18,22.74 97.18,19.44 98.78,22.94 113.55,54.42 116.75,50.82 115.45,45.02 115.55,47.22 115.45,52.12 102.29,61.33 104.73,60.59 105.63,63.89
  pour Top (rank 2): 123.54,104.27 123.54,0 122.54,-1 61.54,-1 61.54,22.17 64.78,25.41 64.78,28.56 60.96,32.38 60.96,72.52 65.91,77.47 65.91,77.85 66.04,77.98 66.04,104.27
  pour Bottom (rank 2): 123.54,104.27 123.54,0 122.54,-1 61.54,-1 61.54,22.17 64.78,25.41 64.78,28.56 60.96,32.38 60.96,72.52 65.91,77.47 65.91,77.85 66.04,77.98 66.04,104.27
HV_CURR_MEAS
  Top 0.152: R51.1 37.44,28.45 | 37.44,28.45 R50.2 | U4.15 32.25,34.4 33.64,33.01 33.64,30.23 34.41,29.47 36.42,29.47 37.44,28.45
L
  Bottom 1.27: J8.5 28.08,4.33 26.29,2.54 20.58,2.54 19.09,4.03 19.09,42.81 34.5,58.21 34.5,62.82 37.72,66.04 K3.9
L1
  Top 0.152: R25.1 R28.2
L2
  Top 0.152: R28.1 R31.2
L_EXT
  Bottom 1.27: 31.74,75.16 U$4.AC/L | 31.74,75.16 31.74,68.72 29.06,66.05 K4.4 | 31.45,75.4 20.85,86 J6.3 | K3.8 38.32,68.58 31.74,75.16
  Bottom 2.54: U$4.AC/L 31.45,75.4
L_SENSE
  Top 0.152: R31.1 R24.2 27,29.95 27,33.3 29.78,36.08 U4.12
L_SENSE_HV
  Top 0.152: J8.6 28.1,9.56 R25.2
LEDOUT  (via drill 0.35)
  Top 0.152: v112.05,32.53 112.01,32.49 111.08,32.49 107.78,35.8 107.78,37.65 108.33,38.21 108.33,43.67 109.6,44.94 109.6,47.24 | IC1.50 108.53,48.31 109.6,47.24 | R73.1 110.72,47.24 109.6,47.24
  Bottom 0.152: J4.33 104.9,19.38 104.9,22.1 104.23,22.77 104.23,24.71 v112.05,32.53
MISO_HV  (via drill 0.35)
  Top 0.152: R36.2 37.91,51.96 37.91,52.85 37.55,53.21 36.01,53.21 35.48,52.68 v35.48,52.6
  Bottom 0.152: J8.13 39.5,8.26 39.5,10.3 41.39,12.19 41.39,26.25 48.66,33.52 48.66,44.77 43.04,50.39 37.69,50.39 v35.48,52.6
MISO_LV  (via drill 0.35)
  Top 0.152: v111.33,33.09 111.33,33.44 117.38,39.48 117.38,48.87 116.24,50 R33.2
  Bottom 0.152: J4.6 70.91,23.49 97.08,23.49 106.69,33.09 v111.33,33.09
MOSI_HV  (via drill 0.35)
  Top 0.152: v37.3,52.6 37,52.3 R37.2
  Bottom 0.152: J8.15 42,8.22 42,26 49.27,33.27 49.27,45.02 43.29,51 39,51 37.4,52.6 v37.3,52.6
MOSI_LV  (via drill 0.35)
  Top 0.152: R34.2 112.86,50.97 112.86,49.26 113.17,48.95 114.15,48.95 114.7,48.4 115.39,48.4 116.64,47.15 116.64,39.72 111.31,34.38 v110.05,34.38
  Bottom 0.152: J4.4 65.45,21.57 67.97,24.09 96.72,24.09 107.01,34.38 v110.05,34.38
N  (via drill 0.35)
  Top 1.27: v47.5,24.38 47.92,23.96 U$1.4 47.92,23.92 v48.39,24.38
  Bottom 1.27: v48.39,24.38 v47.5,24.38 47.88,24.77 47.88,26.85 51.91,30.88 51.91,47.54 49.15,50.3 49.15,64.39 47.5,66.04 K3.4
  pour Top (no thermals): 46.81,25.13 49.01,25.13 49.01,21.93 46.81,21.93
N$1
  Top 0.152: U$3.7 75.62,54.48 R3.1
N$2
  Top 1.27: K2.5 71.8,32.34 70.29,30.82 FUSE.2
N$3
  Top 0.152: IC2.7 78.49,48.51 79.4,47.6 R74.2 80.19,47.61 82.11,45.69 J12.2
N$4
  Top 0.152: U4.5 26.49,40.76 25.69,41.56 25.12,41.56 Y1.3 C2.1
N$5
  Top 0.152: U$3.6 75.67,53.21 C1.1
N$6
  Top 0.152: R32.1 109.18,50.81 IC1.55
N$7
  Top 0.152: C6.1 26.88,38.6 Y1.1 27.6,40.25 U4.6
N$8
  Top 1.27: K1.8 67.6,37.42 R5.2
N$9
  Top 0.152: R33.1 110.68,51.31 IC1.56
N$10
  Top 0.508: 69.04,51.28 67.54,51.28 66.74,52.08
  Top 0.61: U$3.3 68.71,53.21 | 68.71,53.21 68.97,53.21 | 68.97,53.21 69.04,53.14 69.04,51.98 | 68.34,51.17 68.94,51.17 69.04,51.28 | U$3.3 66.93,53.21 66.74,53.02 | 66.74,53.02 66.74,52.08 | 66.74,52.08 66.74,51.38 66.94,51.17 67.54,51.17 | 68.94,52.08 69.04,51.98 | 69.04,51.98 68.34,51.98 | 69.04,51.98 69.04,51.28 | U$3.4 68.97,52.99 68.97,53.21 | U$3.4 68.58,51.28 69.04,51.28 | U$3.4 67.82,51.94 67.24,52.51 | 67.24,52.51 66.74,53.02 | 66.74,52.08 67.58,52.08 68.71,53.21 | U$3.3 67.92,53.19 67.24,52.51
  Top 1.27: K2.4 K1.9 74.97,39.45 74.55,39.88 70.23,39.88 68.34,41.77 68.34,51.98
N$11
  Top 0.152: C33.1 Y2.1 102.72,58.05 IC1.6
N$12
  Top 0.152: R34.1 111.98,51.81 IC1.57
N$13
  Top 0.152: IC1.58 108.57,52.31 108.95,52.69 114.36,52.69 114.53,52.51 114.53,51.76 R35.1
N$14
  Top 0.152: R36.1 38.82,49.15 35.75,46.08 U4.39
N$15
  Top 0.152: R37.1 35.24,47.59 U4.40
N$16
  Top 0.152: R38.1 33.36,47.57 34.76,46.17 U4.41
N$17
  Top 0.152: U4.42 34.25,46.22 32.52,47.95 32.52,49.91 32.76,50.14 34.39,50.14 R39.1
N$18
  Top 0.152: U$1.6 40.28,22.16 40.16,22.28 C12.1
N$21
  Top 0.152: LED5.C 20.04,55.12 23.84,55.12
  Top 0.406: Q2.3 23.84,53.54 D4.A 23.84,55.12 23.84,57.91 K4.12
N$22
  Top 0.152: U$1.7 39.5,20.89 37.44,22.95 R50.1
N$23
  Top 1.27: U$6.P$1 23.16,75.99 28.41,70.75 K4.5
N$24
  Top 0.152: LED3.C 37.72,54.71 40.41,54.71 D1.A
  Top 0.406: Q3.3 41.98,53.95 D1.A 40.66,54.47 K3.12
N$25
  Top 0.152: LED4.C 8.11,40.82 8.13,40.8
  Top 0.406: Q1.3 8.13,40.8 D5.A 8.13,47.74 K5.12
N$26  (via drill 0.35)
  Top 0.152: LED2.C v92.58,30.48
  Top 0.406: K2.12 83.96,28.62 D2.A 87.44,28.62 88.19,27.87 v88.19,27.27 Q4.3
  Bottom 0.152: v92.58,30.48 92,29.9 90.42,29.9 88,27.47 v88.19,27.27
N$27  (via drill 0.35)
  Top 0.152: LED1.C 93.75,36.59 v93.01,37.32
  Top 0.406: K1.12 83.39,38.22 D3.A 88.13,37.23 v88.29,37.23 Q5.3
  Bottom 0.152: v93.01,37.32 92.63,36.94 88.57,36.94 v88.29,37.23
N$28
  Top 0.254: 99.22,58.03 97.75,59.5 C13.1 97.75,60.21 R55.2
  Top 0.305: IC1.13 99.22,58.03
N$29
  Top 0.254: R56.2 26.07,34.73 C14.1 27.98,36.6 27.98,37.77 28.95,38.76 U4.9
N$30
  Top 0.152: D6.C 89.15,51.92 R1.2
N$31  (via drill 0.35)
  Top 0.152: R48.1 86.18,53.54 v86.74,54.1 | v105.49,62.8 105.49,62.49 106.27,61.72 107.32,61.72 107.57,61.98 Q7.3 | v91.31,56.9 91.31,58.27 95.88,62.84 97.25,62.84 v97.36,62.94
  Bottom 0.152: v105.49,62.8 97.6,62.8 97.45,62.94 v97.36,62.94 | v91.31,56.9 89.53,56.9 v86.74,54.1
N$32
  Top 0.152: R52.2 R49.1
N$34  (via drill 0.35)
  Top 0.152: v105.12,61.48 105.72,60.88 105.72,60.84 108.33,60.84 109.47,61.98 Q8.3 | R52.1 87.12,61.04 93.65,61.04 96.16,63.55 v96.48,63.55
  Bottom 0.152: v96.48,63.55 96.55,63.55 96.55,62.89 97.15,62.28 104.32,62.28 v105.12,61.48
N$36
  Top 0.152: R48.2 R1.1
N$37
  Top 0.152: R53.2 96.16,36.02 LED1.A
N$38
  Top 0.152: R67.2 LED5.A
N$39
  Top 0.152: R57.2 96.52,32.66 96.52,30.48 LED2.A
N$40
  Top 0.152: R63.2 37.11,58.16 LED3.A
N$42
  Top 0.152: LED4.A 7,35.85 R66.2
N$43  (via drill 0.35)
  Top 0.152: D7.C 87.69,57.23 v87.69,57.35 | R49.2 85.98,55.23 v85.19,55.23
  Bottom 0.152: v87.69,57.35 87.56,57.35 85.44,55.23 v85.19,55.23
N$44
  Top 0.152: C32.1 103.12,61.78 Y2.3 103.42,61.32 102.5,60.4 102.5,58.7 103.22,57.98 IC1.5
N_OUT
  Top 1.27: U$1.1 47.92,13.92 44.56,10.56 44.56,8.24 | J8.18 J8.20 | J8.20 J8.19 | J8.19 J8.17 | J8.17 J8.18 | J8.18 J8.19 | J8.20 44.56,8.24 | 44.56,8.24 J8.17
  Bottom 1.27: J8.20 J8.18 | J8.18 J8.17 | J8.17 J8.19 | J8.19 J8.20 | J8.20 J8.17 | J8.18 J8.19
  pour Top (no thermals): 46.81,21.13 49.01,21.13 49.01,18.13 46.81,18.13
PILOT1_SENSE
  Top 0.152: R45.2 R40.1 | R41.2 R45.2 | R45.2 84.58,51.84 85.43,52.68 86.78,52.68 87.34,53.24 87.34,53.57 88,54.22 93.48,54.22 94.89,52.81 IC1.22
PILOT_OUT  (via drill 0.35)
  Top 0.152: J7.10 86.97,8.27 86.97,6.62 89.1,4.49 112.69,4.49 116.03,7.82 116.03,23.11 115.5,23.63 94.26,23.63 90.08,27.8 90.08,46.65 89.04,47.7 83.81,47.7 83.25,48.26 83.25,50.65 82.9,51 81.26,51 81.06,51.2 81.06,52.43 81.32,52.69 84.7,52.69 85.09,53.09 85.09,54.34 84.2,55.23 | R42.2 84.07,55.35 84.2,55.23 | D7.A 88.27,58.92 v88.27,58.67 | v84.2,54.57 84.2,55.23
  Bottom 0.152: v88.27,58.67 87.77,58.67 84.2,55.1 v84.2,54.57
PILOT_OUT1
  Top 0.152: J7.8 84.43,8.27 84.43,6.62 86.86,4.19 112.82,4.19 116.33,7.7 116.33,23.23 115.63,23.93 94.38,23.93 90.39,27.93 90.39,47.03 89.15,48.27 D6.A 88.27,48.02 84.57,48.02 84.03,48.56 R40.2
PILOT_SENSE
  Top 0.152: 83.96,57.08 84.03,57 R42.1 84.41,56.67 84.56,56.67 85.1,56.13 86.73,56.13 87.22,55.65 87.22,54.89 87.59,54.52 93.61,54.52 94.82,53.31 IC1.21 | R43.2 84.03,57.15 83.96,57.08 | R44.2 81.98,57.08 83.96,57.08
RCD  (via drill 0.35)
  Top 0.152: Q6.3 92.58,49.72 90.69,47.83 90.69,28.05 94.51,24.24 115.76,24.24 116.64,23.36 116.64,17.78 | J7.6 81.89,8.27 81.89,6.62 84.63,3.88 112.94,3.88 116.64,7.57 116.64,17.78 | 116.64,17.78 v117.22,17.78
  Bottom 0.152: v117.22,17.78 111.42,17.78 J4.39
RCD_CTRL  (via drill 0.35)
  Top 0.152: IC1.23 v94.11,52.31 93.99,52.31 93.53,52.77 Q6.1 | R72.1 93.51,55.5 v93.73,55.5
  Bottom 0.152: v93.73,55.5 93.73,52.69 v94.11,52.31
RCD_TEST  (via drill 0.35)
  Top 0.152: R47.2 117.78,51.12 117.78,39.45 113.26,34.93 v113.26,31.17
  Bottom 0.152: J4.37 109.9,19.3 114.94,19.3 117.48,21.84 117.48,26.36 116.34,27.5 116.34,28.66 113.83,31.17 v113.26,31.17
RCD_TEST_SENSE
  Top 0.152: R46.2 R47.1 115.26,55.15 113.09,52.99 108.67,52.99 108.49,52.81 IC1.59
RSA  (via drill 0.35)
  Top 0.152: J7.12 89.51,8.27 89.51,5.5 90.21,4.79 112.57,4.79 115.72,7.95 115.72,22.98 115.38,23.32 105.14,23.32 v104.84,23.02 | U5.6 109,28.7 R69.1 109.22,27.4 v109.11,27.29
  Bottom 0.152: v109.11,27.29 v104.84,23.02
RSB  (via drill 0.35)
  Top 0.152: J7.14 92.05,8.27 92.05,5.99 92.94,5.1 112.44,5.1 115.42,8.08 115.42,22.85 115.25,23.02 106.05,23.02 v105.75,22.72 | U5.7 109,29.97 R69.2 110.28,30.19 v110.49,29.97
  Bottom 0.152: v110.49,29.97 110.49,27.81 105.75,23.07 v105.75,22.72
SCL  (via drill 0.35)
  Top 0.152: 91.61,45.72 91.61,47.24 93.67,49.31 IC1.29 | v94.44,2.46 94.94,2.97 113.32,2.97 117.55,7.19 117.55,16.38 118.44,17.27 118.44,18.29 117.55,19.18 117.55,23.74 116.14,25.15 94.96,25.15 91.67,28.45 91.67,37.27 92.36,37.96 92.36,42.17 R61.1 91.61,43.11 91.61,45.72 | IC2.6 78.39,47.24 81.19,44.44 87.97,44.44 88.29,44.77 88.92,44.77 v89.48,44.21 | v91.98,46.09 91.61,45.72
  Bottom 0.152: v94.44,2.46 94.44,5.88 J7.15 | v89.48,44.21 89.48,44.59 90.98,46.09 v91.98,46.09
SCLK_HV  (via drill 0.35)
  Top 0.152: v34.57,52.6 34.38,52.6 33.36,51.58 R38.2
  Bottom 0.152: J8.14 41.09,12.39 41.09,26.38 48.35,33.65 48.35,44.65 42.91,50.09 37.09,50.09 v34.57,52.6
SCLK_LV  (via drill 0.35)
  Top 0.152: R32.2 116.33,45.37 116.33,39.91 111.61,35.19 109.45,35.19 v109.41,35.15
  Bottom 0.152: J4.2 66.74,24.4 96.44,24.4 107.19,35.15 v109.41,35.15
SDA  (via drill 0.35)
  Top 0.152: 92.46,44.29 R62.1 92.63,43.99 | v93.44,2.46 94.04,1.86 94.79,1.86 95.54,2.61 113.45,2.61 117.85,7.01 117.85,16.26 118.74,17.15 118.74,18.41 117.85,19.3 117.85,23.91 116.26,25.5 95.12,25.5 91.98,28.64 91.98,37.14 92.67,37.84 92.67,40.6 93.31,41.24 93.31,43.31 92.63,43.99 | IC1.30 93.74,48.81 92.51,47.58 v92.51,46.9 92.63,46.78 92.63,43.99 | v88.54,44.16 88.52,44.14 80.98,44.14 79.15,45.97 IC2.5
  Bottom 0.152: v93.44,2.46 93.44,4.32 90.78,6.98 J7.13 | v88.54,44.16 88.46,44.24 91.11,46.9 v92.51,46.9
SENSE_OUT
  Top 1.27: J5.3 6.09,70.91 U$6.P$2 21.01,70.91 K4.8
SPI2_MISO  (via drill 0.35)
  Top 0.152: v98.15,42.73 98.72,43.3 IC1.35
  Bottom 0.152: J7.5 81.89,8.27 81.89,9.92 84.05,12.09 116.51,12.09 119.05,14.62 119.05,27.95 105.21,41.79 98.91,41.79 98.15,42.54 v98.15,42.73
SPI2_MOSI  (via drill 0.35)
  Top 0.152: IC1.36 99.22,42.76 v99.06,42.6
  Bottom 0.152: J7.7 84.43,8.27 84.43,9.92 86.29,11.78 116.64,11.78 119.35,14.49 119.35,28.07 105.01,42.42 99.25,42.42 v99.06,42.6
SPI2_SCLK  (via drill 0.35)
  Top 0.152: v98.01,43.74 98.22,43.96 IC1.34
  Bottom 0.152: J7.9 86.97,8.27 86.97,9.92 88.52,11.48 116.76,11.48 119.66,14.37 119.66,28.2 105.13,42.72 99.87,42.72 98.81,43.78 98.04,43.78 v98.01,43.74
STM_BOOT0  (via drill 0.35)  (1 unrouted)
  Top 0.152: v102.93,26.11 103.19,25.86 | 103.19,25.86 | 103.19,25.86 116.14,25.86 117.93,27.64 117.93,35.43 119.4,36.9 119.4,63.79 115.95,67.24 J1.4
  Bottom 0.152: J4.23 92.14,19.32 92.14,21.6 92.83,22.29 99.11,22.29 v102.93,26.11
STM_HV_BOOT0  (via drill 0.35)
  Top 0.152: U4.44 v33.24,45.6 33.24,46.61 31.54,48.31 R19.2 | U$5.13 56.67,48.01 51.39,48.01 47.97,44.58 v47.56,44.58
  Bottom 0.152: v47.56,44.58 47.56,44.8 45.37,46.99 34.59,46.99 33.24,45.65 v33.24,45.6
STM_HV_BOOT0_ISO  (via drill 0.35)
  Top 0.152: U$5.4 65,48.7 v65.04,48.74
  Bottom 0.152: v65.04,48.74 66.3,48.74 92.18,74.62 92.18,88.35 94.36,90.53 112.43,90.53 J3.4
STM_HV_RST  (via drill 0.35)
  Top 0.152: U4.7 30.8,39.75 31.05,40 v36.35,40 36.45,40 | U$5.14 57.27,47.53 52.9,47.53 51.65,47.53 | 51.65,47.53 51.61,47.53 v47.35,43.27 | R18.1 51.65,47.53
  Bottom 0.152: v47.35,43.27 47.45,43.27 47.45,42.54 44.91,40 v36.35,40
STM_HV_RST_ISO  (via drill 0.35)
  Top 0.152: U$5.3 v65.03,47.44 v65.04,47.44 | J11.3 99.06,95.25 100.33,96.52 112.78,96.52 114.08,95.22 J3.3
  Bottom 0.152: v65.04,47.44 65.04,47.88 64.43,48.49 64.43,48.99 64.88,49.43 66.56,49.43 91.88,74.75 91.88,88.47 94.23,90.83 110.73,90.83 J3.3
STM_HV_RX
  Top 0.152: U4.31 41.12,40.25 51.42,50.55 54.76,50.55 55.33,49.98 U$5.12
STM_HV_RX_ISO  (via drill 0.35)
  Top 0.152: v65.5,50.04 63.58,50.04 U$5.5
  Bottom 0.152: J3.2 112.08,94.12 109.09,91.14 94.11,91.14 91.57,88.6 91.57,74.98 66.63,50.04 v65.5,50.04
STM_HV_SWCLK  (via drill 0.35)
  Top 0.152: U4.37 36.74,45.34 v36.87,45.47 | v45.55,42.27 45.75,42.06 52.35,42.06 54.41,40.01 U$2.11
  Bottom 0.152: v36.87,45.47 36.87,46.01 37.55,46.69 41.13,46.69 v45.55,42.27
STM_HV_SWCLK_ISO  (via drill 0.35)
  Top 0.152: U$2.6 v65.41,40.01
  Bottom 0.152: v65.41,40.01 65.41,44.58 64.13,45.85 64.13,51.62 64.66,52.15 67.88,52.15 90.96,75.23 90.96,88.85 93.85,91.75 94.64,91.75 J11.2
STM_HV_SWDIO  (via drill 0.35)
  Top 0.152: v44.75,41.66 44.85,41.56 52.42,41.56 55.24,38.73 U$2.12 | v39.75,41.78 38.25,41.78 U4.34
  Bottom 0.152: v39.75,41.78 40.03,42.06 44.35,42.06 v44.75,41.66
STM_HV_SWDIO_ISO  (via drill 0.35)
  Top 0.152: U$2.5 v65.41,38.73
  Bottom 0.152: v65.41,38.73 64.77,39.37 64.77,44.78 63.82,45.73 63.82,51.74 64.54,52.46 67.76,52.46 90.66,75.36 90.66,88.98 95.06,93.38 J11.1
STM_HV_TX  (via drill 0.35)
  Top 0.152: U4.30 41.05,39.75 51.2,49.9 v54.1,49.9 | v54.7,51.2 54.74,51.24 U$5.11
  Bottom 0.152: v54.1,49.9 54.7,50.5 v54.7,51.2
STM_HV_TX_ISO  (via drill 0.35)
  Top 0.152: v65.5,51.3 63.57,51.3 U$5.6
  Bottom 0.152: J3.1 110.08,94.04 107.48,91.44 93.98,91.44 91.27,88.73 91.27,75.1 67.46,51.3 v65.5,51.3
STM_LV_BOOT0  (via drill 0.35)
  Top 0.152: R60.2 110.54,53.96 v109.64,53.96 108.88,53.96 108.23,53.31 IC1.60
  Bottom 0.152: v109.64,53.96 109.27,54.34 109.27,56.49 108.3,57.47 108.3,77.5 J2.4
STM_LV_RST  (via drill 0.35)
  Top 0.152: v102.17,56.01 102.17,57.26 IC1.7 | R59.1 105.11,70.7 v106.23,70.7
  Bottom 0.152: 106.68,86.61 112.91,86.61 114.08,85.44 J2.3 | 106.68,86.61 100.31,86.61 99.06,85.36 J9.3 | 106.68,86.61 106.53,86.46 106.53,70.7 | 106.53,70.7 106.53,61.4 103.89,58.75 103.89,57.72 v102.17,56.01 | v106.23,70.7 106.53,70.7
STM_LV_RX  (via drill 0.35)
  Top 0.152: IC1.43 102.72,47.95 v104.77,50
  Bottom 0.152: J2.2 107.14,80.34 107.14,53.34 107.14,51.81 105.32,50 v104.77,50
STM_LV_SWCLK  (via drill 0.35)
  Top 0.152: J9.2 97.06,83.75 100.42,80.39 107.2,80.39 107.5,80.69 108.13,80.69 108.49,80.33 108.49,79.4 v108.46,79.38 | IC1.49 108.14,47.81 v108.33,47.62
  Bottom 0.152: v108.46,79.38 107.95,78.87 107.95,57.26 108.8,56.4 108.8,53.6 109,53.4 109.06,53.4 109.06,48.35 v108.33,47.62
STM_LV_SWDIO  (via drill 0.35)
  Top 0.152: v107.88,80.08 100.25,80.08 J9.1 | IC1.46 104.22,48.38 v104.77,48.92
  Bottom 0.152: v107.88,80.08 107.44,79.64 107.44,51.59 v104.77,48.92
STM_LV_TX  (via drill 0.35)
  Top 0.152: IC1.42 102.22,48.5 v103.72,50
  Bottom 0.152: J2.1 110.08,83.76 106.83,80.51 106.83,52.03 105.5,50.7 104.42,50.7 v103.72,50
STM_RST  (via drill 0.35)
  Top 0.152: v117.25,27.95 117.42,28.12 117.42,35.35 119.1,37.03 119.1,63.58 113.95,68.72 J1.3 111.65,78.74 101.42,78.74 J10.3
  Bottom 0.152: J4.9 78.1,13 116.13,13 118.13,15 118.13,27.44 117.62,27.95 v117.25,27.95
STM_RX  (via drill 0.35)
  Top 0.152: J1.2 111.95,70.29 118.79,63.45 118.79,37.2 116.01,34.41 116.01,27.73 115.56,27.28 115.06,27.28 114.66,27.68 v114.66,28.7
  Bottom 0.152: v114.66,28.7 114.02,28.7 106.09,20.77 J4.36
STM_SWCLK  (via drill 0.35)
  Top 0.152: v82.02,48.57 82.02,49.21 78.99,52.24 78.99,57.91 82.93,61.85 v82.93,64.39
  Bottom 0.152: J4.1 60.96,19.98 60.96,21.59 65.41,26.04 68.45,26.04 69.35,25.14 80.13,25.14 81.53,26.54 81.53,48.09 v82.02,48.57 | v82.93,64.39 82.93,64.91 92.49,74.47 95.16,74.47 J10.2
STM_SWDIO  (via drill 0.35)
  Top 0.152: v114.43,29.59 114.43,33.78 118.11,37.46 118.11,63.17 109.78,71.5 99.94,71.5 J10.1
  Bottom 0.152: J4.40 111.17,22.68 114.73,26.24 115.91,27.42 115.91,28.56 115.04,29.44 114.58,29.44 v114.43,29.59
STM_TX  (via drill 0.35)
  Top 0.152: J1.1 109.95,71.86 118.49,63.32 118.49,37.32 115.31,34.14 v115.31,28.05
  Bottom 0.152: v115.31,28.05 114.97,28.05 108.63,21.71 J4.38
TA_CURR_RELAY
  Top 0.152: U4.45 32.76,45.22 32.63,45.35 32.63,46.37 31.03,47.97 29.72,47.97 | 29.72,47.97 26.06,47.97 24.86,49.17 Q2.1 | R68.2 29.72,47.97
VCC  (via drill 0.35)
  Top 0.152: U3.1 89.99,63.85 90.34,63.5 90.34,62.3 89.99,61.95 U3.3 | C18.2 73.64,56.23 U$3.8 | C39.1 68.14,59.68 67.91,59.45 | R53.1 94.46,34.29 | 94.46,34.29 R57.1 | 94.46,34.29 92.73,34.29 v92.71,34.31 | R73.2 113.94,45.72 v114.43,45.72 | v108.9,66.04 107.76,67.18 96.65,67.18 v96.52,67.31 | v90.17,67.31 89.47,67.31 89.3,67.48 | v88.65,32.77 87.23,32.77 D2.C
  Top 0.508: U$3.1 70.59,55.75 U$3.8
  Top 0.61: 89.04,65.03 C29.1 | 80.29,42.51 K1.1 86.9,42.51 D3.C | 80.29,42.51 78.26,44.54 75.58,44.54 74.3,45.81 v74.3,47.72 | 80.29,42.51 80.3,42.49 80.3,35.52 82.59,33.23 K2.1 86.8,32.34 D2.C | v70.59,51.48 70.59,55.75 | C3.1 62.99,65.41 62.99,64.9 62.87,64.77 61.72,64.77
  Top 0.813: U3.1 89.04,65.03
  Top 1.016: C5.+ 89.06,67.47 89.06,66.61 89.02,66.58 C29.1
  Top 1.27: 83.94,83.16 83.2,83.16 U$4.V+ 74.65,81.13 71.35,81.13 62.22,72 62.22,70.03 C43.+ 62.52,67.55 C4.1 62.85,65.55 C3.1 | C42.+ 83.94,83.16 | 83.94,83.16 83.18,82.4 83.18,81.53 | C38.1 68.14,57.8 C39.1
  Top 1.778: C43.+ 62.02,70.23 61.65,70.23 61.72,70.16 61.72,64.77 DC2.2 61.82,63.23 61.82,60.92 63.29,59.45 67.91,59.45 67.91,55.76 U$3.1
  Top 2.54: U$4.V+ 81.55,83.16 83.18,81.53 84.74,79.97 C21.+ 84.74,74.66 89.3,70.1 89.3,67.48 C5.+ | 83.2,83.16 86.1,86.06 C42.+
  Bottom 0.152: v92.71,34.31 91.17,32.77 v88.65,32.77 | v108.9,66.04 108.65,65.79 108.65,57.55 110.25,55.94 110.25,49.9 v114.43,45.72 | v96.52,67.31 v90.17,67.31
  Bottom 0.61: v74.3,47.72 72.82,47.72 70.59,49.95 v70.59,51.48
  pour Top (no thermals): 66.54,56.08 66.54,54.16 69.04,54.16 69.04,56.08
VCC_OUT  (via drill 0.35)
  Top 0.152: R11.2 108.96,37.47 108.64,37.47 108.38,37.21 v108.38,36.81 | 65.79,32.89 65.79,32.76
  Top 1.27: J4.31 J4.29 | J4.29 J4.27 | J4.29 98.47,14.93 97.24,13.7 78.15,13.7 | 71.83,13.71 78.18,13.71 78.15,13.74 J4.13 78.15,13.7 | 71.83,13.71 70.53,15.01 J4.7 J4.8 70.53,22.47 68.04,24.96 v68.04,25.23 68.06,25.25 68.06,27.32 | 71.83,13.71 71.84,13.7 78.15,13.7 | FUSE.1 68.06,27.32 | R5.1 65.79,32.89 | 65.79,32.76 65.79,29.59 68.06,27.32
  Bottom 0.152: v108.38,36.81 96.41,24.83 68.43,24.83 v68.04,25.23
VDD  (via drill 0.35)
  Top 0.152: C7.1 39.71,44.39 | 36.9,35.77 36.75,35.77 U4.24 | 59.14,46.9 59.3,46.9 59.2,46.8 56.5,46.8 56.42,46.88 56.26,46.88 56.03,47.1 53.75,47.1 R18.2
  Top 0.254: 38.41,42.94 U4.36
  Top 0.305: U4.24 36.74,36.96 v36,37.7 | U4.48 31.26,42.9 31.26,42.74 | U4.1 31.26,42.74 | 31.26,42.74 v32.1,41.9 | U4.36 36.84,42.74 v36,41.9
  Top 0.406: 38.41,42.94 38.41,43.09 39.71,44.39 | C8.1 38.1,34.58 36.9,35.77 | C9.1 30.88,43.27 31.26,42.9
  Top 0.508: U$5.16 59.12,44.9 59.14,44.87 | U$2.16 58.63,33.66 59.14,34.16 59.14,41.27 | 59.14,44.87 59.14,41.27 | U$2.10 59.14,41.27 | 59.14,44.87 59.14,46.9 59.14,52.07 58.7,52.52 U$5.10 49.44,52.52 49.24,52.32 | C10.1 23.62,36.1 v25.3,36.1 R56.1
  Top 0.813: C7.1 v39.03,44.4 v39.02,44.4 41.3,46.67 44.49,46.67 49.24,51.43 49.24,52.32 49.24,60.58 51.81,63.15 C22.+
  Bottom 0.508: 32.1,39.3 28.9,36.1 v25.3,36.1
  Bottom 0.813: v36,41.9 v32.1,41.9 32.1,39.3 | v36,41.9 35.4,41.3 35.4,38.3 v36,37.7 | v36,41.9 36.1,41.9 38.6,44.4 v39.02,44.4
  pour Top (no thermals): 52.05,66.03 52.05,65.43 53.35,64.13 53.35,62.13 50.95,62.13 50.95,65.33 50.85,65.43 50.85,66.03
VDD_TEST
  Top 0.152: J8.9 34.43,8.27 34.43,23.48 R17.2

## Text on the board
tNames: HV IC | LV IC | DUT | TX | RX | RST | GND | BOOT0 | Prism Core TEST BOARD v0.2 2019-08 / Michele Brunelli / Cristiano Griletti